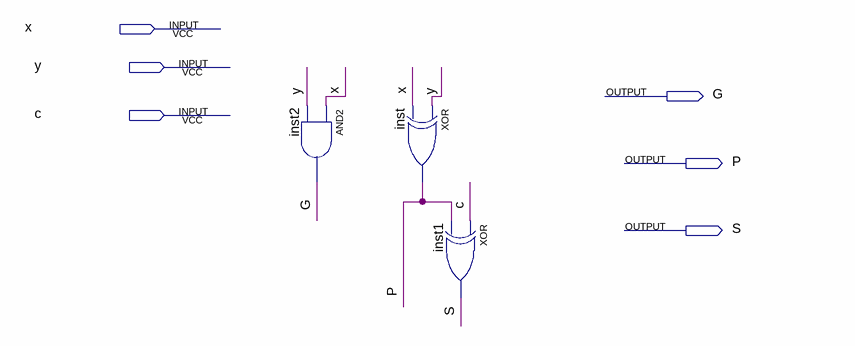
[diagram p0: schematic sheet]
// Quartus schematic B-Cell.bdf as structural Verilog: 3 symbols, 6 pins
module \B-Cell  (
  input  x,
  input  y,
  input  c,
  output G,
  output P,
  output S
);

  and inst2 (G, x, y);
  xor inst (P, y, x);
  xor inst1 (S, c, P);
endmodule
